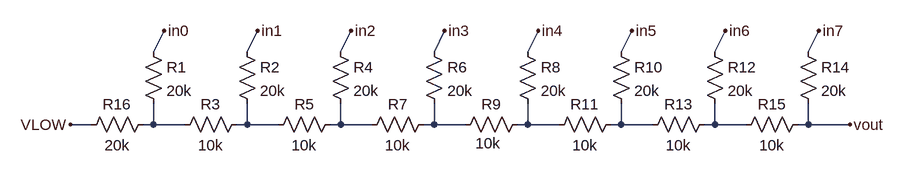
[diagram p0: schematic R2R_ladder.asc]
R2R_ladder.asc, the LTspice schematic file:
Version 4
SHEET 1 2324 680
WIRE 624 80 640 48
WIRE 768 80 784 48
WIRE 912 80 928 48
WIRE 1056 80 1072 48
WIRE 1200 80 1216 48
WIRE 1344 80 1360 48
WIRE 1488 80 1504 48
WIRE 1632 80 1648 48
WIRE 528 192 496 192
WIRE 624 192 624 160
WIRE 624 192 608 192
WIRE 672 192 624 192
WIRE 768 192 768 160
WIRE 768 192 752 192
WIRE 816 192 768 192
WIRE 912 192 912 160
WIRE 912 192 896 192
WIRE 960 192 912 192
WIRE 1056 192 1056 160
WIRE 1056 192 1040 192
WIRE 1104 192 1056 192
WIRE 1200 192 1200 160
WIRE 1200 192 1184 192
WIRE 1248 192 1200 192
WIRE 1344 192 1344 160
WIRE 1344 192 1328 192
WIRE 1392 192 1344 192
WIRE 1488 192 1488 160
WIRE 1488 192 1472 192
WIRE 1536 192 1488 192
WIRE 1632 192 1632 160
WIRE 1632 192 1616 192
WIRE 1696 192 1632 192
FLAG 1648 48 in7
FLAG 1504 48 in6
FLAG 1360 48 in5
FLAG 1216 48 in4
FLAG 1072 48 in3
FLAG 928 48 in2
FLAG 784 48 in1
FLAG 640 48 in0
FLAG 1696 192 vout
FLAG 496 192 VLOW
SYMBOL res 608 64 R0
SYMATTR InstName R1
SYMATTR Value 20k
SYMBOL res 624 176 R90
WINDOW 0 0 56 VBottom 2
WINDOW 3 32 56 VTop 2
SYMATTR InstName R16
SYMATTR Value 20k
SYMBOL res 752 64 R0
SYMATTR InstName R2
SYMATTR Value 20k
SYMBOL res 768 176 R90
WINDOW 0 0 56 VBottom 2
WINDOW 3 32 56 VTop 2
SYMATTR InstName R3
SYMATTR Value 10k
SYMBOL res 896 64 R0
SYMATTR InstName R4
SYMATTR Value 20k
SYMBOL res 912 176 R90
WINDOW 0 0 56 VBottom 2
WINDOW 3 32 56 VTop 2
SYMATTR InstName R5
SYMATTR Value 10k
SYMBOL res 1040 64 R0
SYMATTR InstName R6
SYMATTR Value 20k
SYMBOL res 1056 176 R90
WINDOW 0 0 56 VBottom 2
WINDOW 3 32 56 VTop 2
SYMATTR InstName R7
SYMATTR Value 10k
SYMBOL res 1184 64 R0
SYMATTR InstName R8
SYMATTR Value 20k
SYMBOL res 1200 176 R90
WINDOW 0 0 56 VBottom 2
WINDOW 3 29 61 VTop 2
SYMATTR InstName R9
SYMATTR Value 10k
SYMBOL res 1328 64 R0
SYMATTR InstName R10
SYMATTR Value 20k
SYMBOL res 1344 176 R90
WINDOW 0 0 56 VBottom 2
WINDOW 3 32 56 VTop 2
SYMATTR InstName R11
SYMATTR Value 10k
SYMBOL res 1472 64 R0
SYMATTR InstName R12
SYMATTR Value 20k
SYMBOL res 1488 176 R90
WINDOW 0 0 56 VBottom 2
WINDOW 3 32 56 VTop 2
SYMATTR InstName R13
SYMATTR Value 10k
SYMBOL res 1616 64 R0
SYMATTR InstName R14
SYMATTR Value 20k
SYMBOL res 1632 176 R90
WINDOW 0 0 56 VBottom 2
WINDOW 3 32 56 VTop 2
SYMATTR InstName R15
SYMATTR Value 10k

The netlist it stands for:
* R2R_ladder.asc
R1 in0 N001 20k
R16 N001 VLOW 20k
R2 in1 N002 20k
R3 N002 N001 10k
R4 in2 N003 20k
R5 N003 N002 10k
R6 in3 N004 20k
R7 N004 N003 10k
R8 in4 N005 20k
R9 N005 N004 10k
R10 in5 N006 20k
R11 N006 N005 10k
R12 in6 N007 20k
R13 N007 N006 10k
R14 in7 vout 20k
R15 vout N007 10k
.backanno
.end